# Altium schematic sheet FPGA_IO_Interface.SchDoc
size A4
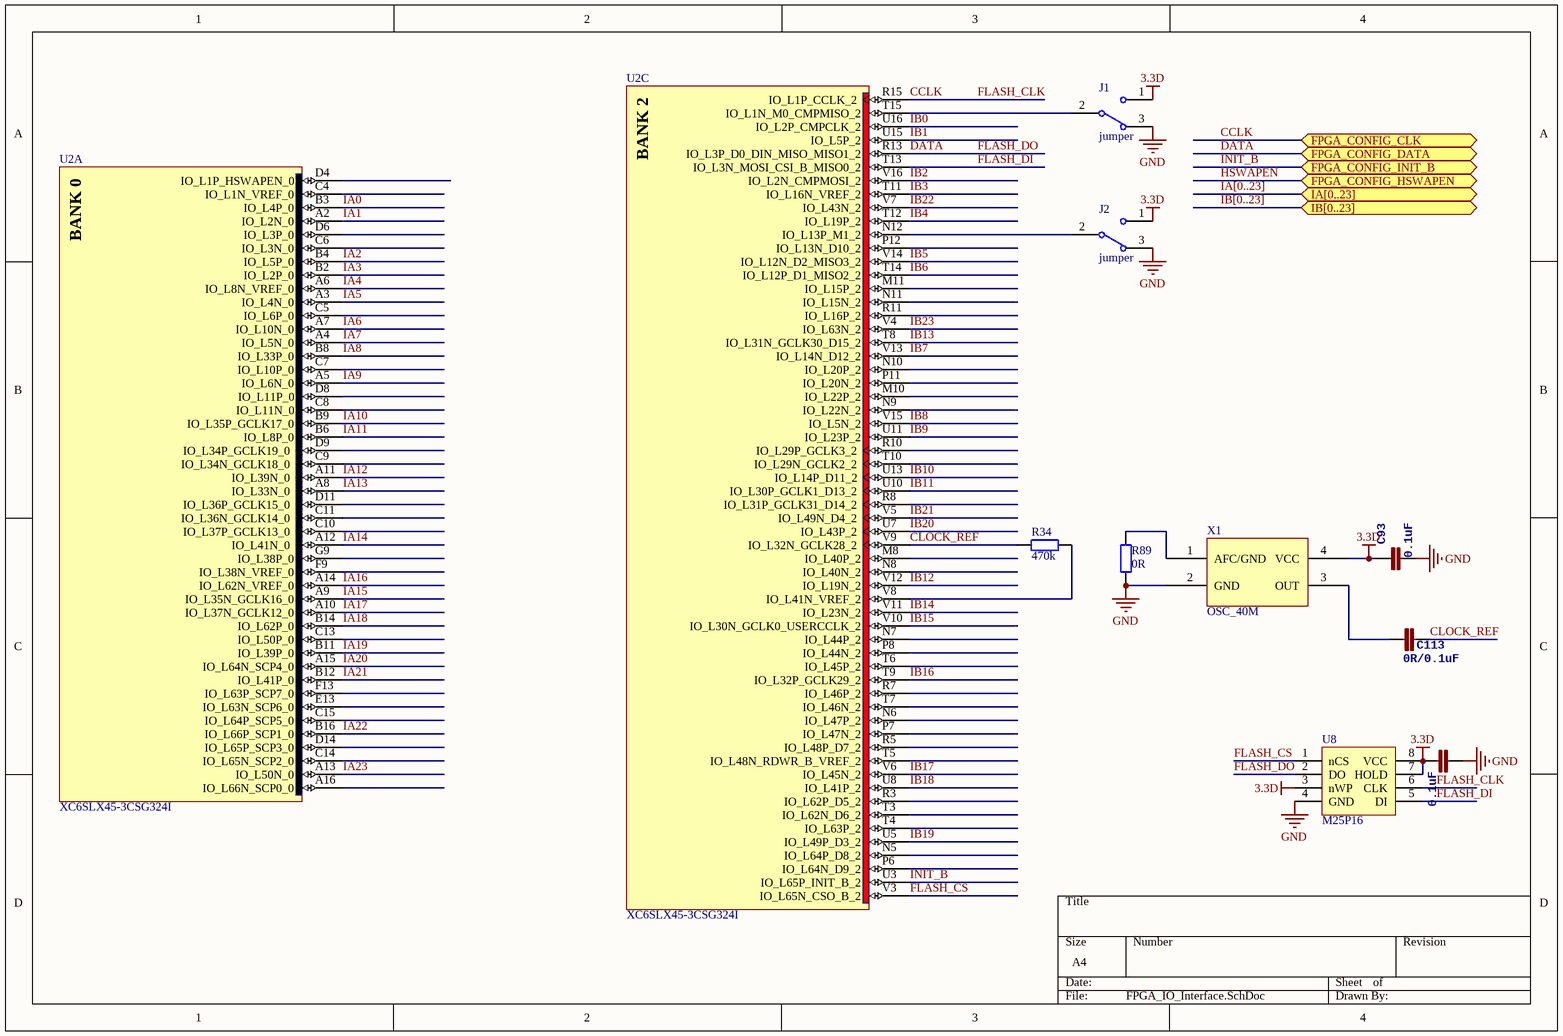
[diagram p0: FPGA_IO_Interface.SchDoc]

## Parts
C68  0.1uF  [0402]
C93  0.1uF  [0402]
C113  0R/0.1uF  [0402]
J1  jumper  [0402J]
J2  jumper  [0402J]
R34  470k  [0402]
R89  0R  [0402]
U2  XC6SLX45-3CSG324I  [CSG324]  (parts A,C of 8)
U8  M25P16  [SO8]
X1  OSC_40M  [TXC_7Q]

## Ports
FPGA_CONFIG_CLK, FPGA_CONFIG_DATA, FPGA_CONFIG_HSWAPEN, FPGA_CONFIG_INIT_B, IA[0..23], IB[0..23]

## Nets
3.3D: C68.2 C93.1 J1.1 J2.1 U8.3(nWP) U8.7(HOLD) U8.8(VCC) X1.4(VCC)
GND: C68.1 C93.2 J1.3 J2.3 R89.2 U8.4(GND) X1.2(GND)
CCLK: U2.R15(IO_L1P_CCLK_2) U8.6(CLK) ; port FPGA_CONFIG_CLK  [also labelled FLASH_CLK]
CLOCK_REF: C113.2 R34.1 U2.V9(IO_L32N_GCLK28_2)
DATA: U2.R13(IO_L3P_D0_DIN_MISO_MISO1_2) U8.2(DO) ; port FPGA_CONFIG_DATA  [also labelled FLASH_DO]
FLASH_CS: U2.V3(IO_L65N_CSO_B_2) U8.1(nCS)
FLASH_DI: U2.T13(IO_L3N_MOSI_CSI_B_MISO0_2) U8.5(DI)
HSWAPEN: port FPGA_CONFIG_HSWAPEN
IA0: U2.B3(IO_L4P_0)
IA1: U2.A2(IO_L2N_0)
IA2: U2.B4(IO_L5P_0)
IA3: U2.B2(IO_L2P_0)
IA4: U2.A6(IO_L8N_VREF_0)
IA5: U2.A3(IO_L4N_0)
IA6: U2.A7(IO_L10N_0)
IA7: U2.A4(IO_L5N_0)
IA8: U2.B8(IO_L33P_0)
IA9: U2.A5(IO_L6N_0)
IA10: U2.B9(IO_L35P_GCLK17_0)
IA11: U2.B6(IO_L8P_0)
IA12: U2.A11(IO_L39N_0)
IA13: U2.A8(IO_L33N_0)
IA14: U2.A12(IO_L41N_0)
IA15: U2.A9(IO_L35N_GCLK16_0)
IA16: U2.A14(IO_L62N_VREF_0)
IA17: U2.A10(IO_L37N_GCLK12_0)
IA18: U2.B14(IO_L62P_0)
IA19: U2.B11(IO_L39P_0)
IA20: U2.A15(IO_L64N_SCP4_0)
IA21: U2.B12(IO_L41P_0)
IA22: U2.B16(IO_L66P_SCP1_0)
IA23: U2.A13(IO_L50N_0)
IB0: U2.U16(IO_L2P_CMPCLK_2)
IB1: U2.U15(IO_L5P_2)
IB2: U2.V16(IO_L2N_CMPMOSI_2)
IB3: U2.T11(IO_L16N_VREF_2)
IB4: U2.T12(IO_L19P_2)
IB5: U2.V14(IO_L12N_D2_MISO3_2)
IB6: U2.T14(IO_L12P_D1_MISO2_2)
IB7: U2.V13(IO_L14N_D12_2)
IB8: U2.V15(IO_L5N_2)
IB9: U2.U11(IO_L23P_2)
IB10: U2.U13(IO_L14P_D11_2)
IB11: U2.U10(IO_L30P_GCLK1_D13_2)
IB12: U2.V12(IO_L19N_2)
IB13: U2.T8(IO_L31N_GCLK30_D15_2)
IB14: U2.V11(IO_L23N_2)
IB15: U2.V10(IO_L30N_GCLK0_USERCCLK_2)
IB16: U2.T9(IO_L32P_GCLK29_2)
IB17: U2.V6(IO_L45N_2)
IB18: U2.U8(IO_L41P_2)
IB19: U2.U5(IO_L49P_D3_2)
IB20: U2.U7(IO_L43P_2)
IB21: U2.V5(IO_L49N_D4_2)
IB22: U2.V7(IO_L43N_2)
IB23: U2.V4(IO_L63N_2)
INIT_B: U2.U3(IO_L65P_INIT_B_2) ; port FPGA_CONFIG_INIT_B
NetC113_1: C113.1 X1.3(OUT)
NetJ1_2: J1.2 U2.T15(IO_L1N_M0_CMPMISO_2)
NetJ2_2: J2.2 U2.N12(IO_L13P_M1_2)
NetR34_2: R34.2 U2.V8(IO_L41N_VREF_2)
NetR89_1: R89.1 X1.1(AFC/GND)

Not connected (* = marked no-connect by the designer): U2 A16(IO_L66N_SCP0_0) C4(IO_L1N_VREF_0) C5(IO_L6P_0) C6(IO_L3N_0) C7(IO_L10P_0) C8(IO_L11N_0) C9(IO_L34N_GCLK18_0) C10(IO_L37P_GCLK13_0) C11(IO_L36N_GCLK14_0) C13(IO_L50P_0) C14(IO_L65N_SCP2_0) C15(IO_L64P_SCP5_0) D4(IO_L1P_HSWAPEN_0) D6(IO_L3P_0) D8(IO_L11P_0) D9(IO_L34P_GCLK19_0) D11(IO_L36P_GCLK15_0) D14(IO_L65P_SCP3_0) E13(IO_L63N_SCP6_0) F9(IO_L38N_VREF_0) F13(IO_L63P_SCP7_0) G9(IO_L38P_0) M8(IO_L40P_2) M10(IO_L22P_2) M11(IO_L15P_2) N5(IO_L64P_D8_2) N6(IO_L47P_2) N7(IO_L44P_2) N8(IO_L40N_2) N9(IO_L22N_2) N10(IO_L20P_2) N11(IO_L15N_2) P6(IO_L64N_D9_2) P7(IO_L47N_2) P8(IO_L44N_2) P11(IO_L20N_2) P12(IO_L13N_D10_2) R3(IO_L62P_D5_2) R5(IO_L48P_D7_2) R7(IO_L46P_2) R8(IO_L31P_GCLK31_D14_2) R10(IO_L29P_GCLK3_2) R11(IO_L16P_2) T3(IO_L62N_D6_2) T4(IO_L63P_2) T5(IO_L48N_RDWR_B_VREF_2) T6(IO_L45P_2) T7(IO_L46N_2) T10(IO_L29N_GCLK2_2)

## Buses and harness runs
bus IA[0..23] = port IA[0..23]
bus IB[0..23] = port IB[0..23]

## Notes on the sheet
- (in symbol XC6SLX45-3CSG324I, part A) BANK 0
- (in symbol XC6SLX45-3CSG324I, part C) BANK 2

## Library data of the parts
C68 C93 C113 = CAP0402-CAP: <b>Capacitor</b> / Standard 0603 ceramic capacitor, and 0.1" leaded capacitor.; PARTNO: CC0402ZRY5V7BB104
J1 J2 = SW-SPDT: SPDT Subminiature Toggle Switch, Right Angle Mounting, Vertical Actuation; Published: 24-Mar-1999; LatestRevisionDate: 17-Dec-2003; LatestRevisionNote: Schematic revised, PCB Footprint replaced.; DatasheetVersion: 05-Dec-2000; PackageReference: TL36WW15050; Publisher: Altium Limited; PackageDescription: Switch; 4 Leads; ComponentLink1Description: Manufacturer Link; ComponentLink1URL: http://www.apem.com
R34 R89 = Res2: Resistor; Value: 0Ohm; Published: 8-Jun-2000; LatestRevisionDate: 17-Jul-2002; LatestRevisionNote: Re-released for DXP Platform.; PackageReference: AXIAL-0.4; Publisher: Altium Limited; PackageDescription: Axial Device, Thru-Hole; 2 Leads; 0.4 in Pin Spacing
U2 = XC6SLX45-3CSG324I: Spartan-6 LX 1.2V FPGA, 218 User I/Os, 324-Ball Chip-Scale BGA (0.8mm Pitch), Speed Grade 3, Industrial Grade, Pb-Free; Published: 17-Nov-2009; DatasheetVersion: ver1.6, Nov-2010; PackageVersion: ver1.1, Nov-2009; PackageReference: CSG324; Publisher: Altium Limited; PackageDescription: 324-Ball Chip-Scale BGA (CSG324) Package, 0.8 mm Pitch; Supplier 1: Digi-Key; Supplier Part Number 1: XC6SLX45-3CSG324I-ND; Code_JEDEC: MO-275-KKAC-1; ComponentLink1Description: Manufacturer Link; ComponentLink1URL: http://www.xilinx.com; ComponentLink2Description: Spartan-6 Datasheet; ComponentLink2URL: http://www.xilinx.com/support/documentation/data_sheets/ds160.pdf; ComponentLink3Description: Spartan-6 Documents; ComponentLink3URL: http://www.xilinx.com/support/documentation/spartan-6.htm; ComponentLink4Description: Xilinx.com Home; ComponentLink4URL: http://www.xilinx.com